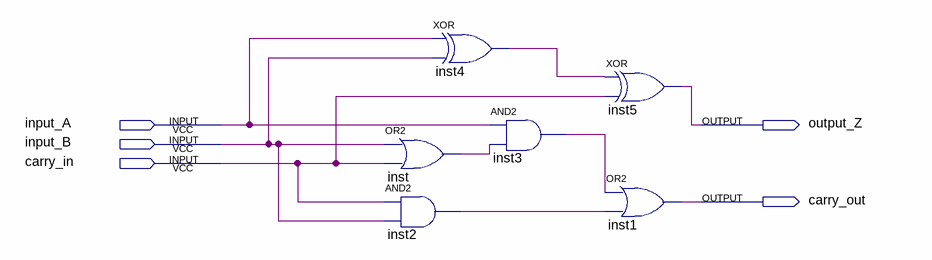
[diagram p0: schematic sheet]
// Quartus schematic somador_bit.bdf as structural Verilog: 6 symbols, 5 pins
module somador_bit (
  input  input_A,
  input  input_B,
  input  carry_in,
  output output_Z,
  output carry_out
);

  wire inst2_out, inst3_out, inst4_out, inst_out;

  or inst (inst_out, input_B, carry_in);
  and inst2 (inst2_out, carry_in, input_B);
  xor inst4 (inst4_out, input_A, input_B);
  and inst3 (inst3_out, input_A, inst_out);
  xor inst5 (output_Z, inst4_out, carry_in);
  or inst1 (carry_out, inst3_out, inst2_out);
endmodule
